# Altium schematic sheet ltk-hall_main_tc_heater.SchDoc: MAIN / TC + HEATER
size A3; Organization: Altium Limited; Address1: L3, 12a Rodborough Rd; Address2: Frenchs Forest; Address3: NSW; Address4: Australia 2086; DocumentNumber: 4; SheetNumber: 4; SheetTotal: 6
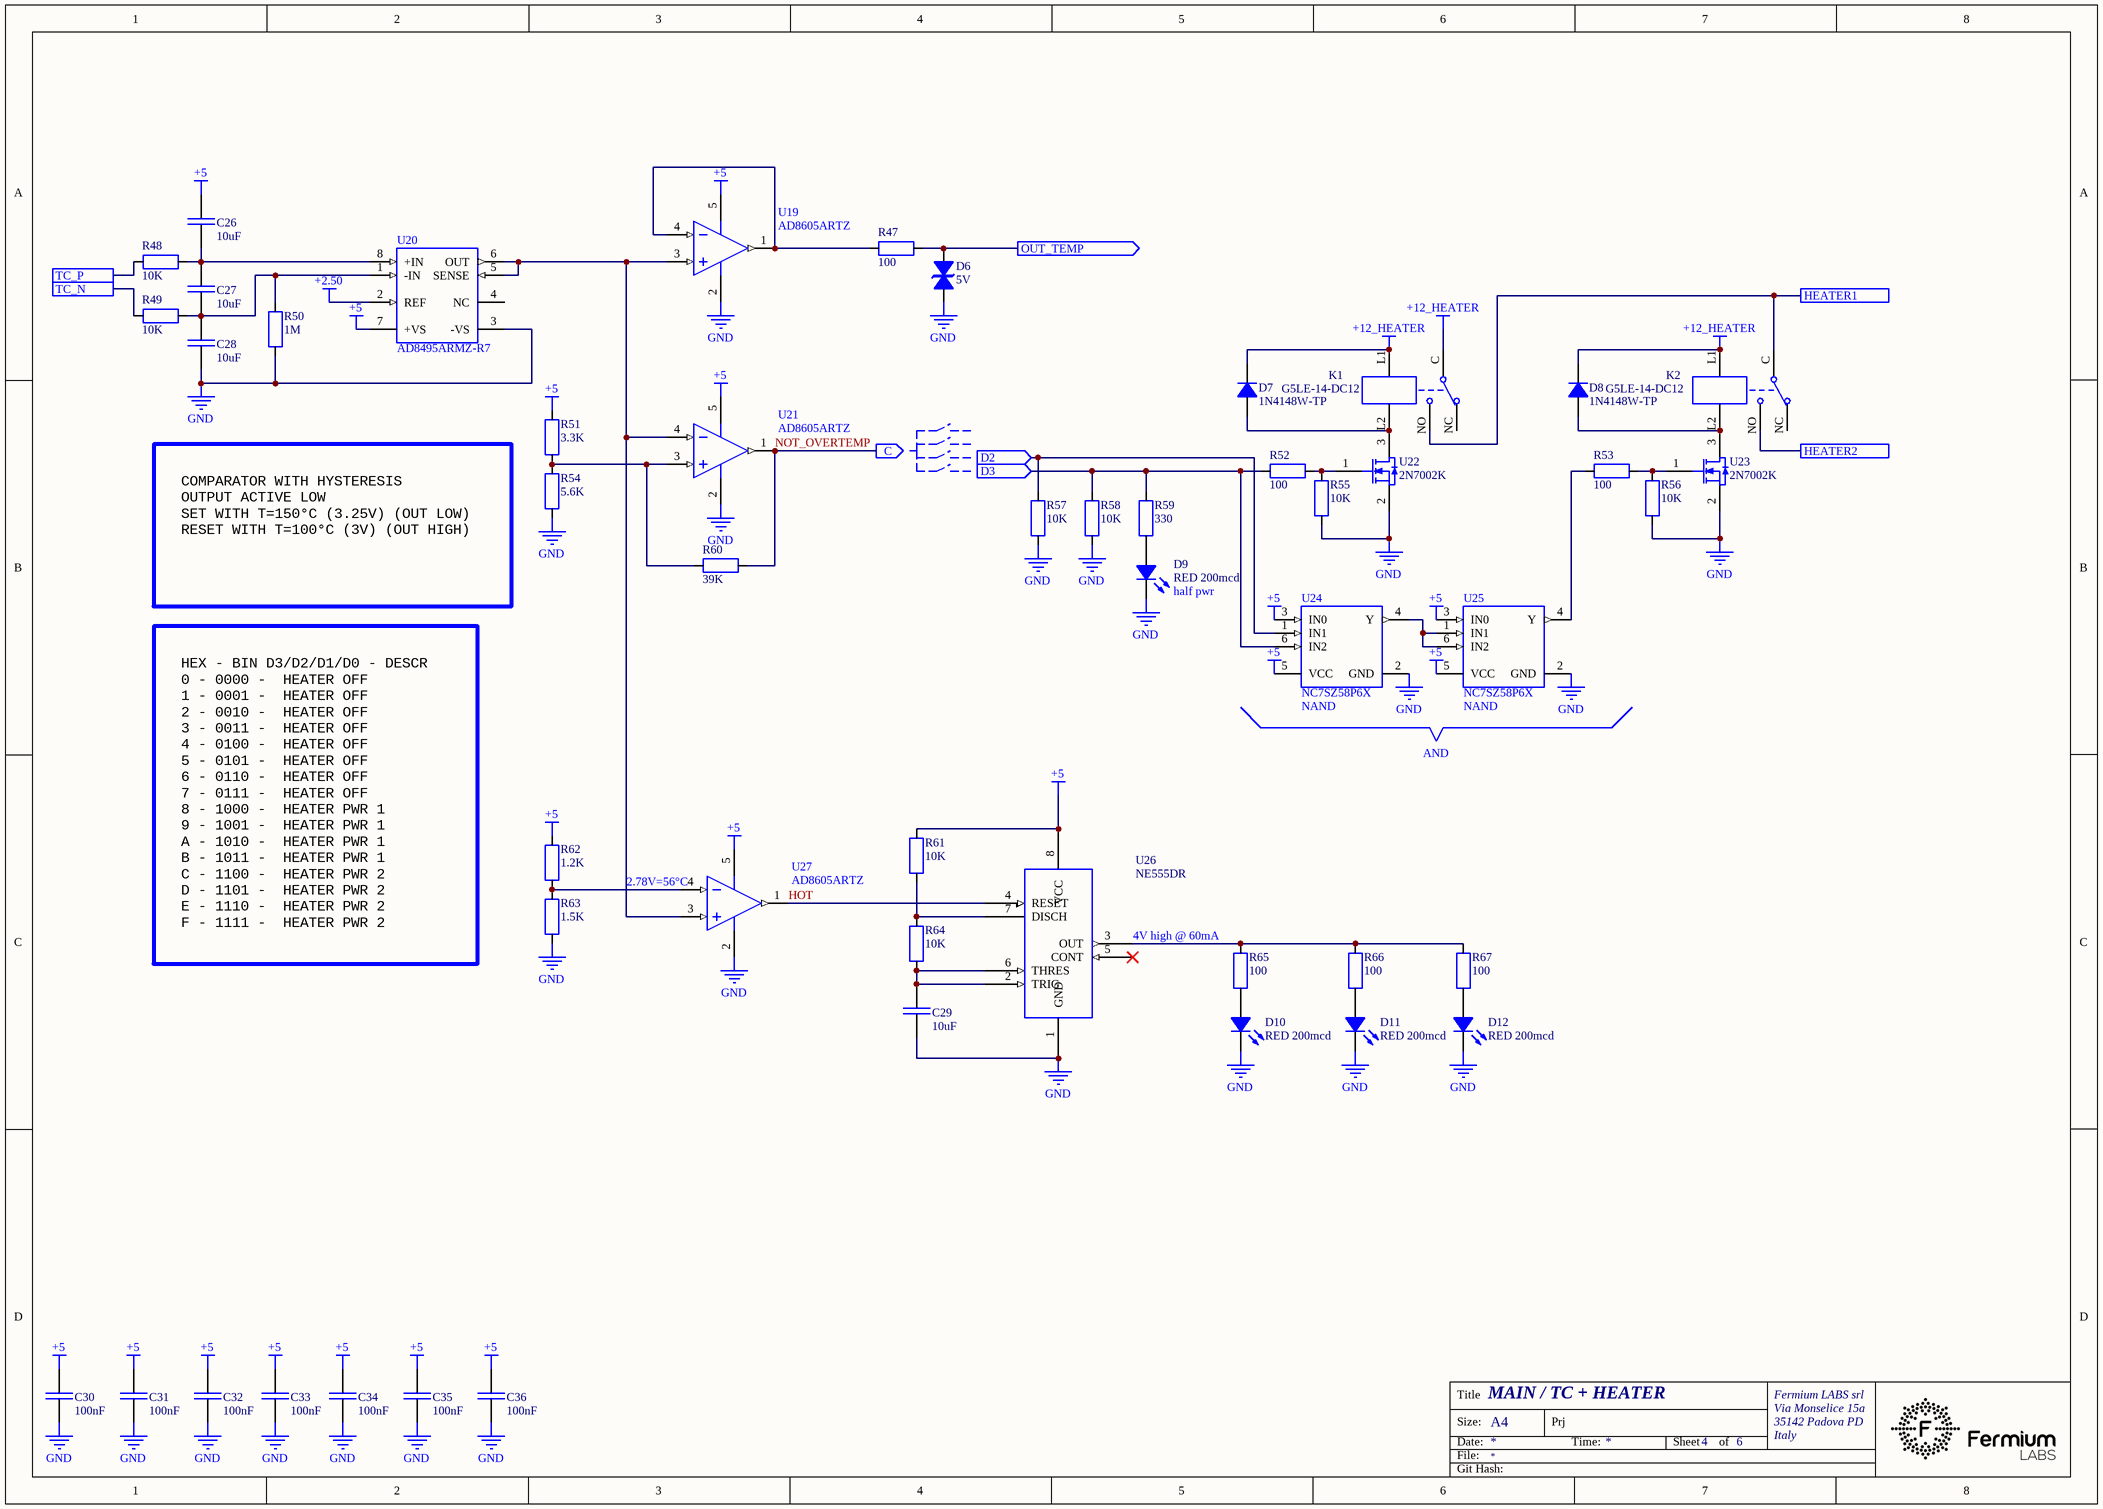
[diagram p0: ltk-hall_main_tc_heater.SchDoc]

## Parts
C26  10uF  [CAP 0805_2012]
C27  10uF  [CAP 0805_2012]
C28  10uF  [CAP 0805_2012]
C29  10uF  [CAP 0805_2012]
C30  100nF  [CAP 0603_1608]
C31  100nF  [CAP 0603_1608]
C32  100nF  [CAP 0603_1608]
C33  100nF  [CAP 0603_1608]
C34  100nF  [CAP 0603_1608]
C35  100nF  [CAP 0603_1608]
C36  100nF  [CAP 0603_1608]
D6  5V  [SOD523F]
D7  1N4148W-TP  [SOD-123]
D8  1N4148W-TP  [SOD-123]
D9  RED 200mcd  [ED49B4F6-595F-4D62-96BB-D7184CAA9B94]
D10  RED 200mcd  [ED49B4F6-595F-4D62-96BB-D7184CAA9B94]
D11  RED 200mcd  [ED49B4F6-595F-4D62-96BB-D7184CAA9B94]
D12  RED 200mcd  [ED49B4F6-595F-4D62-96BB-D7184CAA9B94]
K1  G5LE-14-DC12  [AAE46D0F-8D2F-4914-8614-C04E242B4758]
K2  G5LE-14-DC12  [AAE46D0F-8D2F-4914-8614-C04E242B4758]
R47  100  [RES 0603_1608]
R48  10K  [RES 0603_1608]
R49  10K  [RES 0603_1608]
R50  1M  [RES 0603_1608]
R51  3.3K  [RES 0603_1608]
R52  100  [RES 0603_1608]
R53  100  [RES 0603_1608]
R54  5.6K  [RES 0603_1608]
R55  10K  [RES 0603_1608]
R56  10K  [RES 0603_1608]
R57  10K  [RES 0603_1608]
R58  10K  [RES 0603_1608]
R59  330  [RES 0603_1608]
R60  39K  [RES 0603_1608]
R61  10K  [RES 0603_1608]
R62  1.2K  [RES 0603_1608]
R63  1.5K  [RES 0603_1608]
R64  10K  [RES 0603_1608]
R65  100  [RES 0603_1608]
R66  100  [RES 0603_1608]
R67  100  [RES 0603_1608]
U19  AD8605ARTZ  [A3DDA0BC-073E-4B18-9613-F713A7EC1E27]
U20  AD8495ARMZ-R7  [ANALOG MSOP-8 RM-8]
U21  AD8605ARTZ  [A3DDA0BC-073E-4B18-9613-F713A7EC1E27]
U22  2N7002K  [ON SEMI SOT-23-3]
U23  2N7002K  [ON SEMI SOT-23-3]
U24  NC7SZ58P6X  [CF792C6F-51F3-4C59-9918-AD84EFC14FA6]
U25  NC7SZ58P6X  [CF792C6F-51F3-4C59-9918-AD84EFC14FA6]
U26  NE555DR  [TI SOIC-8 D]
U27  AD8605ARTZ  [A3DDA0BC-073E-4B18-9613-F713A7EC1E27]

## Ports
C (out), D2 (in), D3 (in), HEATER1, HEATER2, OUT_TEMP (out), TC_N, TC_P

## Nets
+2.50: U20.2(REF)
+5: C26.2 C30.1 C31.1 C32.1 C33.1 C34.1 C35.1 C36.1 R51.2 R61.2 R62.2 U19.5(+V) U20.7(+VS) U21.5(+V) U24.3(IN0) U24.5(VCC) U25.3(IN0) U25.5(VCC) U26.8(VCC) U27.5(+V)
+12_HEATER: D7.1(K) D8.1(K) K1.C K1.L1 K2.L1
GND: C28.1 C29.1 C30.2 C31.2 C32.2 C33.2 C34.2 C35.2 C36.2 D6.2 D9.1(K) D10.1(K) D11.1(K) D12.1(K) R50.1 R54.1 R55.1 R56.1 R57.1 R58.1 R63.1 U19.2(-V) U20.3(-VS) U21.2(-V) U22.2(S) U23.2(S) U24.2(GND) U25.2(GND) U26.1(GND) U27.2(-V)
D2: R57.2 U24.1(IN1) ; port D2
D3: R52.1 R58.2 R59.2 U24.6(IN2) ; port D3
HEATER1: K1.NO K2.C ; port HEATER1
HEATER2: K2.NO ; port HEATER2
HOT: U26.4(RESET) U27.1(OUT)
NOT_OVERTEMP: R60.2 U21.1(OUT) ; port C
OUT_TEMP: D6.1 R47.2 ; port OUT_TEMP
TC_N: R49.2 ; port TC_N
TC_P: R48.2 ; port TC_P
NetC26_1: C26.1 C27.2 R48.1 U20.8(+IN)
NetC27_1: C27.1 C28.2 R49.1 R50.2 U20.1(-IN)
NetC29_2: C29.2 R64.1 U26.2(TRIG) U26.6(THRES)
NetD7_2: D7.2(A) K1.L2 U22.3(D)
NetD8_2: D8.2(A) K2.L2 U23.3(D)
NetD9_2: D9.2(A) R59.1
NetD10_2: D10.2(A) R65.1
NetD11_2: D11.2(A) R66.1
NetD12_2: D12.2(A) R67.1
NetR47_1: R47.1 U19.1(OUT) U19.4(-IN)
NetR51_1: R51.1 R54.2 R60.1 U21.3(+IN)
NetR52_2: R52.2 R55.2 U22.1(G)
NetR53_1: R53.1 U25.4(Y)
NetR53_2: R53.2 R56.2 U23.1(G)
NetR61_1: R61.1 R64.2 U26.7(DISCH)
NetR62_1: R62.1 R63.2 U27.4(-IN)
NetR65_2: R65.2 R66.2 R67.2 U26.3(OUT)
NetU19_3: U19.3(+IN) U20.5(SENSE) U20.6(OUT) U21.4(-IN) U27.3(+IN)
NetU24_4: U24.4(Y) U25.1(IN1) U25.6(IN2)

Not connected (* = marked no-connect by the designer): K1 NC; K2 NC; U20 4(NC); U26 5(CONT)*

## Notes on the sheet
- COMPARATOR WITH HYSTERESIS
  OUTPUT ACTIVE LOW
  SET WITH T=150°C (3.25V) (OUT LOW)
  RESET WITH T=100°C (3V) (OUT HIGH)
- (near D9) half pwr
- (near U24) NAND
- (near U25) NAND
- AND
- (near U27) 2.78V=56°C
- HEX - BIN D3/D2/D1/D0 - DESCR
  0 - 0000 -  HEATER OFF
  1 - 0001 -  HEATER OFF
  2 - 0010 -  HEATER OFF
  3 - 0011 -  HEATER OFF
  4 - 0100 -  HEATER OFF
  5 - 0101 -  HEATER OFF
  6 - 0110 -  HEATER OFF
  7 - 0111 -  HEATER OFF
  8 - 1000 -  HEATER PWR 1
  9 - 1001 -  HEATER PWR 1
  A - 1010 -  HEATER PWR 1
  B - 1011 -  HEATER PWR 1
  C - 1100 -  HEATER PWR 2
  D - 1101 -  HEATER PWR 2
  E - 1110 -  HEATER PWR 2
  F - 1111 -  HEATER PWR 2
- 4V high @ 60mA
- Title
- Fermium LABS srl
- Size:
- Date:
- File:
- A4
- Prj
- Time:
- Sheet
- of
- Via Monselice 15a
- 35142 Padova PD
- Italy
- Git Hash:

## Library data of the parts
C26-C29 = 1ffbe5a9-0884-4740-bdad-20a6a98400e6: CAP SMD MLCC 10uF 25V 0805 X5R; Manufacturer 1: Samsung Electro-Mechanics; Manufacturer Part Number 1: CL21A106KAYNNNE; id: 14779; S 1: LCSC; SPN 1: C84416; SPN 2: C15850; Part Number: 1ffbe5a9-0884-4740-bdad-20a6a98400e6; ComponentLink1Description: Datasheet; ComponentLink1URL: http://localhost:8080/static/files/Samsung-Electro-Mechanics-CL21A106KAYNNNE_C158502019-03-10_213827.610739.pdf?Samsung-Electro-Mechanics-CL21A106KAYNNNE_C15850.pdf; Manufacturer 2: Murata; Manufacturer Part Number 2: GRM21BR61E106KA73L; Value: 10uF; S 2: LCSC
C30-C36 = 02841f84-ac15-41b5-9e17-915f8f067828: CAP SMD MLCC 100nF 25V 0603 X7R; Manufacturer 1: Samsung Electro-Mechanics; Manufacturer Part Number 1: CL10B104KA8NNNC; id: 14784; S 1: LCSC; SPN 1: C1590; SPN 2: C14663; Part Number: 02841f84-ac15-41b5-9e17-915f8f067828; ComponentLink1Description: Datasheet; ComponentLink1URL: http://localhost:8080/static/files/Samsung-Electro-Mechanics-CL10B104KA8NNNC_C15902019-03-10_215548.826887.pdf?Samsung-Electro-Mechanics-CL10B104KA8NNNC_C1590.pdf; Value: 100nF; Manufacturer 2: Yageo; Manufacturer Part Number 2: CC0603KRX7R9BB104; S 2: LCSC
D6 = daa58212-38e2-4326-a156-8e48058c46f1: DIODE SMD TVS 5V BIDIRECTIONAL SOD-523; Manufacturer 1: Born Semiconductor; Manufacturer Part Number 1: PESD5V0S1BBN; id: 14837; S 1: LCSC; SPN 1: C314264; SPN 2: C97640; Part Number: daa58212-38e2-4326-a156-8e48058c46f1; ComponentLink1Description: Datasheet; ComponentLink1URL: http://localhost:8080/static/files/Nexperia-PESD5V0S1BB-115_C976402019-08-16_201905.624024.pdf?Nexperia-PESD5V0S1BB-115_C97640.pdf; ComponentLink2Description: Datasheet; ComponentLink2URL: http://localhost:8080/static/files/1901051701_Bourne-Semicon-Shenzhen-PESD5V0S1BBN_C3142642019-08-16_201911.992552.pdf?1901051701_Bourne-Semicon-Shenzhen-PESD5V0S1BBN_C314264.pdf; Manufacturer 2: Nexperia; Manufacturer Part Number 2: PESD5V0S1BB,115; Value: 5V; S 2: LCSC
D7 D8 = 5e920700-75df-48e3-84dd-8f9f777caed8: DIODE SMD 100V 150mA 1.5Vf SOD-123 4148; Manufacturer 1: MCC; id: 14795; S 1: LCSC; SPN 1: C77978; Part Number: 5e920700-75df-48e3-84dd-8f9f777caed8; ComponentLink1Description: Datasheet; ComponentLink1URL: http://localhost:8080/static/files/Micro-Commercial-Components-MCC-1N4148W-TP_C779782019-04-06_215019.428643.pdf?Micro-Commercial-Components-MCC-1N4148W-TP_C77978.pdf; Manufacturer Part Number 1: 1N4148W-TP
D9-D12 = c65ae3d2-9539-4634-8979-616a331b7494: DIODE LED THT 5MM RED 200mcd; Manufacturer 1: Everlight; Manufacturer Part Number 1: 333-2SURD/S530-A3-L; id: 14851; S 1: LCSC; SPN 1: C99758; Part Number: c65ae3d2-9539-4634-8979-616a331b7494; ComponentLink1Description: Datasheet; ComponentLink1URL: http://localhost:8080/static/files/Everlight-Elec-333-2SURD-S530-A3-L_C997582019-08-18_181624.501044.pdf?Everlight-Elec-333-2SURD-S530-A3-L_C99758.pdf; Value: RED 200mcd
K1 K2 = daf6f3cd-58c4-4886-bcb7-b7b47a76ae08: RELAY SPDT 10A 250VAC 12VDC SUBMINIATURE; Manufacturer 1: Omron; id: 14836; S 1: LCSC; SPN 1: C116964; Part Number: daf6f3cd-58c4-4886-bcb7-b7b47a76ae08; ComponentLink1Description: Datasheet; ComponentLink1URL: http://localhost:8080/static/files/Omron-Electronics-G5LE-14-DC12_C116964_12019-08-16_200915.378527.pdf?Omron-Electronics-G5LE-14-DC12_C116964 (1).pdf; Manufacturer Part Number 1: G5LE-14-DC12
R47 R52 R53 R65-R67 = 0a6c4b74-f837-4563-b154-6e196d753525: RES SMD 100 OHM 1% 1/10W 0603; Manufacturer 1: Yageo; Manufacturer Part Number 1: RC0603FR-07100RL; id: 12301; S 1: LCSC; SPN 1: C105588; SPN 2: C22775; Part Number: 0a6c4b74-f837-4563-b154-6e196d753525; Value: 100; Manufacturer 2: Uniroyal; Manufacturer Part Number 2: 0603WAF1000T5E; S 2: LCSC
R48 R49 R55-R58 R61 R64 = 93242766-ba1d-462d-b58f-ce1dfc4129c8: RES SMD 10K OHM 1% 1/10W 0603; Manufacturer 1: Yageo; Manufacturer Part Number 1: RC0603FR-0710KL; id: 12101; S 1: LCSC; SPN 1: C98220; SPN 2: C25804; Part Number: 93242766-ba1d-462d-b58f-ce1dfc4129c8; Value: 10K; Manufacturer 2: Uniroyal; Manufacturer Part Number 2: 0603WAF1002T5E; S 2: LCSC
R50 = 99181d84-3ebc-4ea4-8625-26dc8592276c: RES SMD 1M OHM 1% 1/10W 0603; Manufacturer 1: Yageo; Manufacturer Part Number 1: RC0603FR-071ML; id: 12196; S 1: LCSC; SPN 1: C105578; SPN 2: C22935; Part Number: 99181d84-3ebc-4ea4-8625-26dc8592276c; Value: 1M; Manufacturer 2: Uniroyal; Manufacturer Part Number 2: 0603WAF1004T5E; S 2: LCSC
R51 = c685e076-af25-4fed-81c8-3eb7c43f01b8: RES SMD 3.3K OHM 1% 1/10W 0603; Manufacturer 1: Yageo; Manufacturer Part Number 1: RC0603FR-073K3L; id: 12615; S 1: LCSC; SPN 1: C108078; SPN 2: C22978; Part Number: c685e076-af25-4fed-81c8-3eb7c43f01b8; Value: 3.3K; Manufacturer 2: Uniroyal; Manufacturer Part Number 2: 0603WAF3301T5E; S 2: LCSC
R54 = afc45e5f-a770-4ee7-b734-99356076b47f: RES SMD 5.6K OHM 1% 1/10W 0603; Manufacturer 1: Yageo; Manufacturer Part Number 1: RC0603FR-075K6L; id: 12513; S 1: LCSC; SPN 1: C23189; SPN 2: C114627; Part Number: afc45e5f-a770-4ee7-b734-99356076b47f; Value: 5.6K; Manufacturer 2: Uniroyal; Manufacturer Part Number 2: 0603WAF5601T5E; S 2: LCSC
R59 = e8555d7b-eeda-4727-b2e1-550cdc03d819: RES SMD 330 OHM 1% 1/10W 0603; Manufacturer 1: Yageo; Manufacturer Part Number 1: RC0603FR-07330RL; id: 12350; S 1: LCSC; SPN 1: C105881; SPN 2: C23138; Part Number: e8555d7b-eeda-4727-b2e1-550cdc03d819; Value: 330; Manufacturer 2: Uniroyal; Manufacturer Part Number 2: 0603WAF3300T5E; S 2: LCSC
R60 = 10a824dc-98f1-41df-91f2-219e0508d035: RES SMD 39K OHM 1% 1/10W 0603; Manufacturer 1: Yageo; Manufacturer Part Number 1: RC0603FR-0739KL; id: 12426; S 1: LCSC; SPN 1: C23153; SPN 2: C163424; Part Number: 10a824dc-98f1-41df-91f2-219e0508d035; Value: 39K; Manufacturer 2: Uniroyal; Manufacturer Part Number 2: 0603WAF3902T5E; S 2: LCSC
R62 = 2f6201d5-48c6-41ab-ab40-2cc6255291b8: RES SMD 1.2K OHM 1% 1/10W 0603; Manufacturer 1: Yageo; Manufacturer Part Number 1: RC0603FR-071K2L; id: 12078; S 1: LCSC; SPN 1: C114605; SPN 2: C22765; Part Number: 2f6201d5-48c6-41ab-ab40-2cc6255291b8; Value: 1.2K; Manufacturer 2: Uniroyal; Manufacturer Part Number 2: 0603WAF1201T5E; S 2: LCSC
R63 = d098bc01-c90d-4b51-91ee-1d9d1ccd8970: RES SMD 1.5K OHM 1% 1/10W 0603; Manufacturer 1: Yageo; Manufacturer Part Number 1: RC0603FR-071K5L; id: 12166; S 1: LCSC; SPN 1: C22843; SPN 2: C114668; Part Number: d098bc01-c90d-4b51-91ee-1d9d1ccd8970; Value: 1.5K; Manufacturer 2: Uniroyal; Manufacturer Part Number 2: 0603WAF1501T5E; S 2: LCSC
U19 U21 U27 = 5610e9ea-bca8-49b2-8e5f-11409231f6a4: IC OPAMP 65uV 1pA RRIO 5V 80mA SOT-23-5; Manufacturer 1: Analog Devices; id: 14830; S 1: LCSC; SPN 1: C9641; Part Number: 5610e9ea-bca8-49b2-8e5f-11409231f6a4; ComponentLink1Description: Datasheet; ComponentLink1URL: http://localhost:8080/static/files/Analog_Devices-AD8605ARTZ-REEL7-datasheet2019-08-16_175825.352099.pdf?Analog_Devices-AD8605ARTZ-REEL7-datasheet.pdf; Manufacturer Part Number 1: AD8605ARTZ
U20 = 8cc7f909-42c7-4251-909a-43740f41a1ca: IC THERMOCOUPLE AMPLIFIER MSOP-8; Manufacturer 1: Analog Devices; id: 14832; S 1: LCSC; SPN 1: C59658; Part Number: 8cc7f909-42c7-4251-909a-43740f41a1ca; ComponentLink1Description: Datasheet; ComponentLink1URL: http://localhost:8080/static/files/Analog-Devices-ADI-AD8495ARMZ-R7_C596582019-08-16_182304.166986.pdf?Analog-Devices-ADI-AD8495ARMZ-R7_C59658.pdf; Manufacturer Part Number 1: AD8495ARMZ-R7
U22 U23 = 3a318f0a-3b94-47d9-91d5-8fc0a2f410e8: MOSFET N-CHANNEL LOGIC LEVEL 300mA 3ohm 60V ESD-PROT 2N7002K SOT-23; Manufacturer 1: ON Semiconductor; Manufacturer Part Number 1: 2N7002KT1G; id: 14846; S 1: LCSC; SPN 1: C81445; SPN 2: C116584; SPN 3: C85047; Part Number: 3a318f0a-3b94-47d9-91d5-8fc0a2f410e8; ComponentLink1Description: Datasheet; ComponentLink1URL: http://localhost:8080/static/files/ON-Semicon-ON-2N7002KT1G_C1165842019-08-17_164859.682835.pdf?ON-Semicon-ON-2N7002KT1G_C116584.pdf; ComponentLink2Description: Datasheet; ComponentLink2URL: http://localhost:8080/static/files/Vishay-Intertech-2N7002K-T1-GE3_C814452019-08-17_164907.199439.pdf?Vishay-Intertech-2N7002K-T1-GE3_C81445.pdf; ComponentLink3Description: Datasheet; ComponentLink3URL: http://localhost:8080/static/files/DATA; Manufacturer 2: Vishay; Manufacturer 3: Diodes Inc.; Manufacturer Part Number 2: 2N7002K-T1-GE3; Manufacturer Part Number 3: 2N7002K-7; S 2: LCSC; S 3: LCSC
U24 U25 = 22da43c7-1950-42f4-bc93-10d9cca79b4d: IC LOGIC PORT CONFIGURABLE AND, OR, NAND, NOR, XOR, BUFFER, NOT 8ns  74XX58 SC-70; Manufacturer 1: ON Semiconductor; id: 14841; S 1: LCSC; SPN 1: C232804; SPN 2: C7842; Part Number: 22da43c7-1950-42f4-bc93-10d9cca79b4d; ComponentLink1Description: Datasheet; ComponentLink1URL: http://localhost:8080/static/files/1812220431_ON-Semicon-ON-NC7SZ58P6X_C2328042019-08-17_005741.293796.pdf?1812220431_ON-Semicon-ON-NC7SZ58P6X_C232804.pdf; ComponentLink2Description: Datasheet; ComponentLink2URL: http://localhost:8080/static/files/Texas-Instruments-TI-SN74LVC1G58DCKR_C78422019-08-17_005749.189474.pdf?Texas-Instruments-TI-SN74LVC1G58DCKR_C7842.pdf; Manufacturer 2: Texas Instruments; Manufacturer Part Number 1: NC7SZ58P6X; Manufacturer Part Number 2: SN74LVC1G58DCKR; S 2: LCSC
U26 = d16ab88a-2543-469a-8940-7b800b633548: IC SMD TIMER NE555 SOIC-8; Manufacturer 1: Texas Instruments; id: 14787; S 1: LCSC; SPN 1: C7593; Part Number: d16ab88a-2543-469a-8940-7b800b633548; ComponentLink1Description: Datasheet; ComponentLink1URL: http://localhost:8080/static/files/Texas-Instruments-TI-NE555DR_C7593_22019-03-10_221020.033506.pdf?Texas-Instruments-TI-NE555DR_C7593 (2).pdf; Manufacturer Part Number 1: NE555DR